# Altium schematic sheet PeripheralCircuit.SchDoc
size A; SheetNumber: 8; SheetTotal: 8
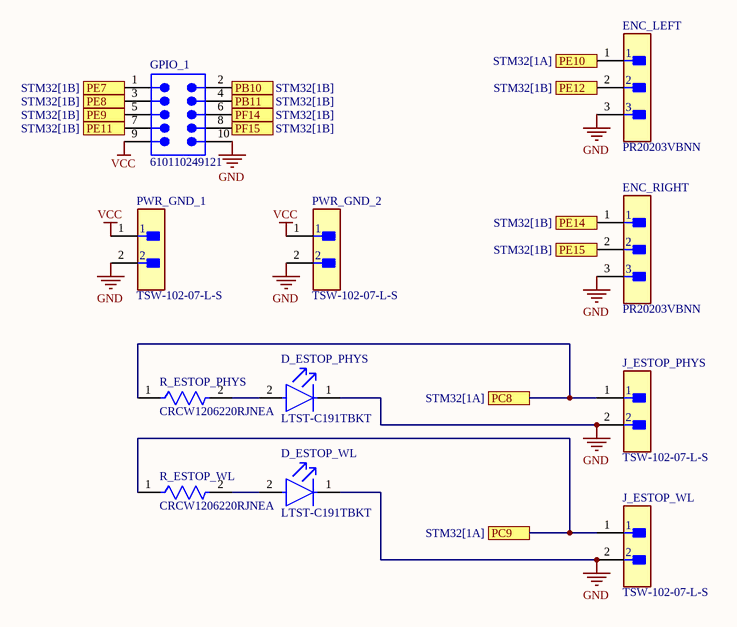
[diagram p0: PeripheralCircuit.SchDoc]

## Parts
D_ESTOP_PHYS  LTST-C191TBKT  [FP-LTST-C191TBKT-MFG]
D_ESTOP_WL  LTST-C191TBKT  [FP-LTST-C191TBKT-MFG]
ENC_LEFT  PR20203VBNN  [FP-PR20203VBNN-MFG]
ENC_RIGHT  PR20203VBNN  [FP-PR20203VBNN-MFG]
GPIO_1  610110249121  [610110249121]
J_ESTOP_PHYS  TSW-102-07-L-S  [FP-TSW-102-07-L-S-MFG]
J_ESTOP_WL  TSW-102-07-L-S  [FP-TSW-102-07-L-S-MFG]
PWR_GND_1  TSW-102-07-L-S  [FP-TSW-102-07-L-S-MFG]
PWR_GND_2  TSW-102-07-L-S  [FP-TSW-102-07-L-S-MFG]
R_ESTOP_PHYS  CRCW1206220RJNEA  [FP-CRCW1206-e3-IPC_C]
R_ESTOP_WL  CRCW1206220RJNEA  [FP-CRCW1206-e3-IPC_C]

## Ports
PB10 (see STM32[1B]), PB11 (see STM32[1B]), PC8 (see STM32[1A]), PC9 (see STM32[1A]), PE7 (see STM32[1B]), PE8 (see STM32[1B]), PE9 (see STM32[1B]), PE10 (see STM32[1A]), PE11 (see STM32[1B]), PE12 (see STM32[1B]), PE14 (see STM32[1B]), PE15 (see STM32[1B]), PF14 (see STM32[1B]), PF15 (see STM32[1B])

## Nets
GND: D_ESTOP_PHYS.1(C) D_ESTOP_WL.1(C) ENC_LEFT.3 ENC_RIGHT.3 GPIO_1.10 J_ESTOP_PHYS.2 J_ESTOP_WL.2 PWR_GND_1.2 PWR_GND_2.2
VCC: GPIO_1.9 PWR_GND_1.1 PWR_GND_2.1
PB10: GPIO_1.2 ; port PB10
PB11: GPIO_1.4 ; port PB11
PC8: J_ESTOP_PHYS.1 R_ESTOP_PHYS.1 ; port PC8
PC9: J_ESTOP_WL.1 R_ESTOP_WL.1 ; port PC9
PE7: GPIO_1.1 ; port PE7
PE8: GPIO_1.3 ; port PE8
PE9: GPIO_1.5 ; port PE9
PE10: ENC_LEFT.1 ; port PE10
PE11: GPIO_1.7 ; port PE11
PE12: ENC_LEFT.2 ; port PE12
PE14: ENC_RIGHT.1 ; port PE14
PE15: ENC_RIGHT.2 ; port PE15
PF14: GPIO_1.6 ; port PF14
PF15: GPIO_1.8 ; port PF15
NetD_ESTOP_PHYS_2: D_ESTOP_PHYS.2(A) R_ESTOP_PHYS.2
NetD_ESTOP_WL_2: D_ESTOP_WL.2(A) R_ESTOP_WL.2

## Library data of the parts
D_ESTOP_PHYS D_ESTOP_WL = CMP-22017-000008-1: LED BLUE CLEAR CHIP SMD; Lens Color: Colorless; Dominant Wavelength: 475nm; Forward Current: 20mA; Wavelength: 468nm; Viewing Angle: 130°; Power Dissipation: 76mW; Luminous Intensity: 180mcd; Reverse Voltage: 5V; Number of Elements: 1; Lens Style: Diffused; Forward Voltage: 3.8V; Max Power Dissipation: 75mW; Case Code (Metric): 1608; Packaging: Tape and Reel; Case/Package: 0603; Depth: 1.6mm; Mount: Surface Mount; Lead Free: Lead Free; Min Operating Temperature: -20°C; Lens Transparency: Clear; Illumination Color: Blue; Height: 0.55mm; Test Current: 20mA; Case Code (Imperial): 0603; Max Operating Temperature: 80°C; Number of Pins: 2; Length: 0.8mm; Radiation Hardening: No; Package Quantity: 1; Number of LEDs: 1; Width: 0.8mm; Color: Blue
ENC_LEFT ENC_RIGHT = CMP-77940-000002-1: CONN HEADER VERT 3POS 2.54MM; Manufacturer: Metz Connect; Conn Orientation: Straight; Current Rating: 3A; Number Of Contacts: 3; Conn Gender: Male; Temperature: -40°C to +105°C; Pitch: 2.54mm; Device Class L1: Connectors; Digikey Description: CONN HEADER VERT 3POS 2.54MM; ComponentLink2URL: https://datasheet.octopart.com/PR20203VBNN-Metz-Connect-datasheet-101610322.pdf; Height: 8.6mm; Temperature Range High: +105°C; Manufacturer Part Number: PR20203VBNN; Number Of Rows: 1; Octopart: https://octopart.com/pr20203vbnn-metz+connect-87667116; Device Class L3: unset; ComponentLink2Description: Datasheet; Device Class L2: Headers and Wire Housings; Temperature Range Low: -40°C; Automotive: No; Contact Material: Gold,Nickel; Category: Conn; Lead Free: Yes; RoHS: TRUE; Package: PR20203VBNN
GPIO_1 = CMP-1502-01148-3: NexarPartId: 52645093; Number of Positions: 10; Connector Type: Male Pin; Row Spacing: 2.54mm; Operating Supply Voltage: 250V; Current Rating: 3A; Contact Resistance: 20mΩ; Gender: Male; Color: Black; Packaging: Tape and Reel; Number of Pins: 10; REACH SVHC: Unknown; Number of Contacts: 10; RoHS: Compliant; Number of Rows: 2; Termination: Solder; Lead Pitch: 2.54mm; Contact Plating: Gold; Contact Mating Length: 5.9944mm; Mount: Surface Mount; Pitch: 2.54mm
J_ESTOP_PHYS J_ESTOP_WL PWR_GND_1 PWR_GND_2 = CMP-02766-001428-1: CONN HEADER VERT 2POS 2.54MM; Voltage Rating: 550V; Current Rating: 7.6A; Gender: Male; Number of Contacts: 2; Connector Type: Male Pin; Radiation Hardening: No; Orientation: Straight; Contact Plating: Gold; Max Operating Temperature: 125°C; Mount: Through Hole; Package Quantity: 1; Number of Rows: 1; Housing Material: Polyester; RoHS Compliant: Yes; Length: 5.08mm; Max Voltage Rating (AC): 550V; Pitch: 2.54mm; Packaging: Bulk; Depth: 2.54mm; Termination: Solder; Min Operating Temperature: -55°C; Housing Color: Black; Lead Free: Lead Free; Color: Black; Number of Positions: 2; Width: 2.54mm; Max Current Rating: 7.6A; REACH SVHC: No SVHC; Contact Material: Bronze; Contact Mating Length: 0.23inch; Series: TSW; Contact Type: Male Pin
R_ESTOP_PHYS R_ESTOP_WL = CMP-1014-00058-3: RES Thick Film, 220Ω, 5%, 0.25W, 200ppm/°C, 1206; Voltage Rating: 200V; Max Power Dissipation: 250mW; Resistance: 220R; Length: 3.2mm; Weight: 0.000353oz; Termination: SMD/SMT; Min Operating Temperature: -55°C; Height: 0.55mm; Temperature Coefficient: 200ppm/°C; Case Code (Imperial): 1206; Max Operating Temperature: 155°C; Depth: 1.6mm; Width: 0.063inch; Lead Free: Lead Free; Tolerance: 5%; Composition: Thick Film; Case Code (Metric): 3216; Features: Automotive AEC-Q200; Number of Terminations: 2; Voltage Rating (DC): 200V; Packaging: Tape and Reel; Case/Package: 1206; Military Standard: Not; Radiation Hardening: No; Contact Plating: Tin; Package Quantity: 5000; Power Rating: 250mW